# EAGLE design weather station 3 (EAGLE 7.2.0)
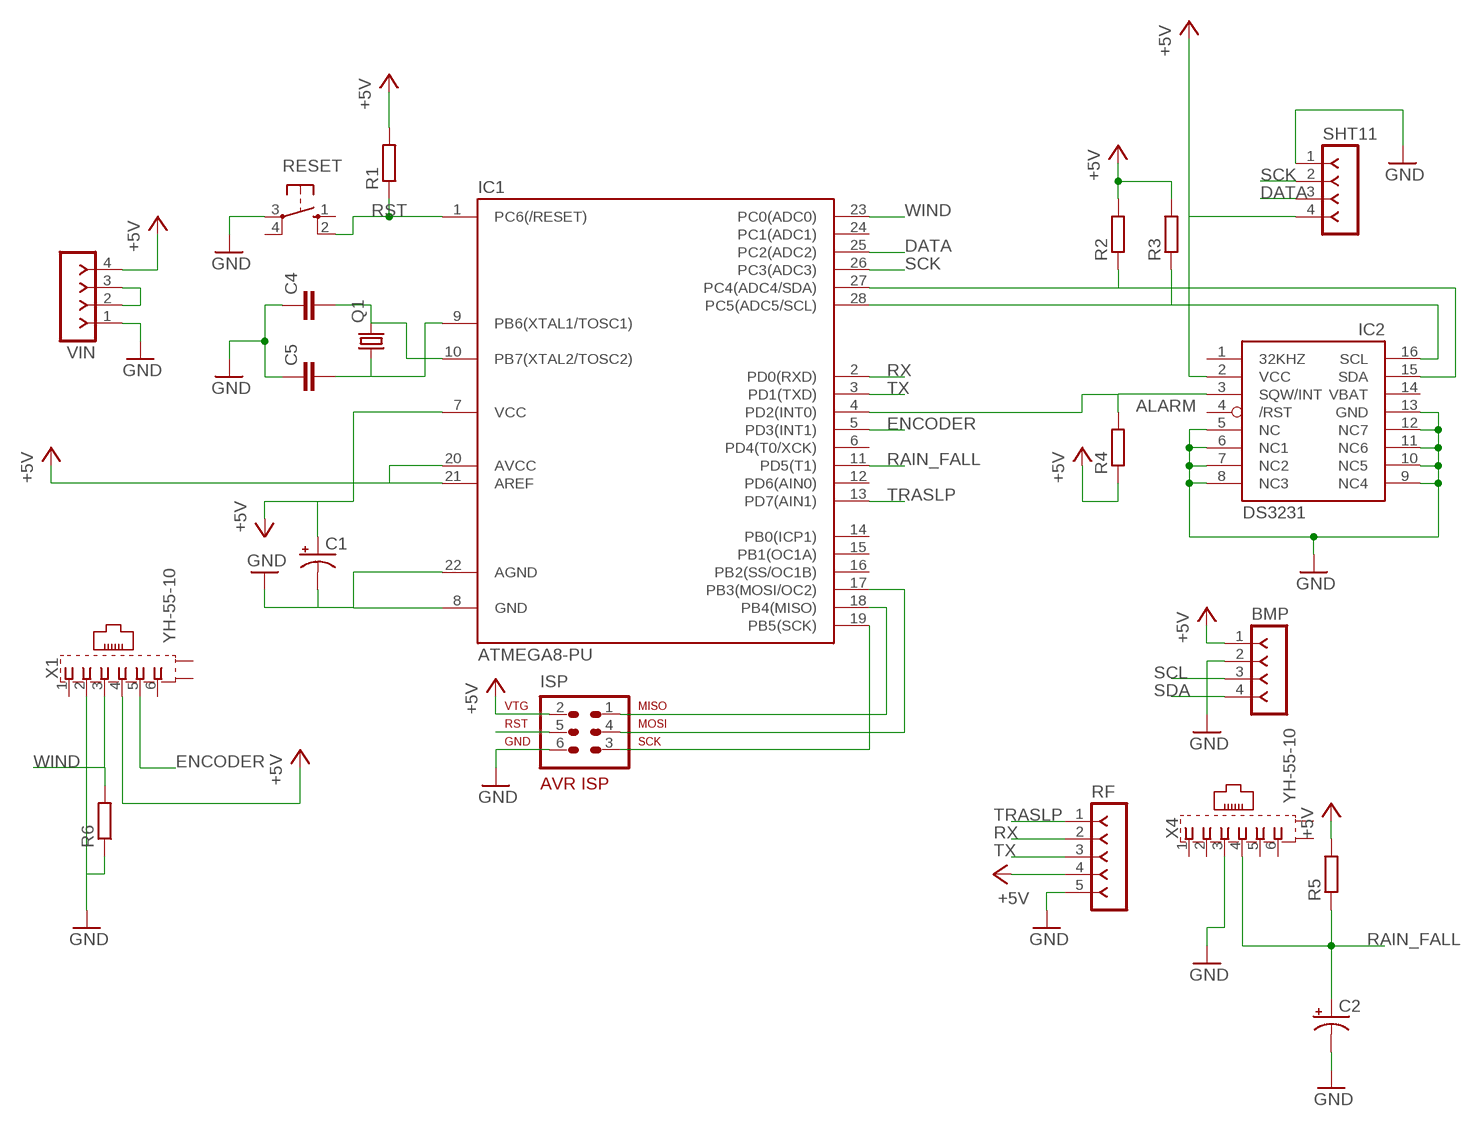
[diagram p0: schematic, sheet 1]

## Parts
BMP  F-1X04-SIP-100-40  [SIP-100-04-40]
C1  10UF-25V-20%(PTH)  [CPOL-RADIAL-10UF-25V]
C2  10UF-25V-20%(PTH)  [CPOL-RADIAL-10UF-25V]
C4  C-EU025-024X044  [C025-024X044]
C5  C-EU025-024X044  [C025-024X044]
IC1  ATMEGA8-PU  [DIL28-3]
IC2  DS3231/SO  [SO16W]
ISP  AVR-ISP-6  [AVR-ISP-6]
Q1  CRYSTALHC49S  [HC49/S]
R1  R-EU_0204/7  [0204/7]
R2  R-EU_0204/7  [0204/7]
R3  R-EU_0204/7  [0204/7]
R4  R-EU_0204/7  [0204/7]
R5  R-EU_0204/7  [0204/7]
R6  R-EU_0204/7  [0204/7]
RESET  10-XX  [B3F-10XX]
RF  F-1X05-SIP-100-40  [SIP-100-05-40]
SHT11  F-1X04-SIP-100-40  [SIP-100-04-40]
VIN  F-1X04-SIP-100-40Y  [SIP-100-04-40Y]
X1  YH-55-10  [YH-55-10]
X4  YH-55-10  [YH-55-10]

## Nets
+5V: BMP.1 C1.1(+) IC1.7(VCC) IC1.20(AVCC) IC1.21(AREF) IC2.2(VCC) ISP.2 R1.2 R2.2 R3.2 R4.1 R5.2 RF.4 SHT11.4 VIN.4 X1.4
ALARM: IC1.4(PD2(INT0)) IC2.3(SQW/INT) R4.2
DATA: IC1.25(PC2(ADC2)) SHT11.3
ENCODER: IC1.5(PD3(INT1)) X1.5
GND: BMP.2 C1.2(-) C2.2(-) C4.1 C5.1 IC1.8(GND) IC1.22(AGND) IC2.5(NC) IC2.6(NC1) IC2.7(NC2) IC2.8(NC3) IC2.9(NC4) IC2.10(NC5) IC2.11(NC6) IC2.12(NC7) IC2.13(GND) ISP.6 R6.1 RESET.3(P) RF.5 SHT11.1 VIN.1 X1.2 X4.3
N$1: VIN.2 VIN.3
N$2: IC1.18(PB4(MISO)) ISP.1
N$3: C4.2 IC1.10(PB7(XTAL2/TOSC2)) Q1.2
N$4: C5.2 IC1.9(PB6(XTAL1/TOSC1)) Q1.1
N$5: IC1.19(PB5(SCK)) ISP.3
N$8: IC1.17(PB3(MOSI/OC2)) ISP.4
RAIN_FALL: C2.1(+) IC1.11(PD5(T1)) R5.1 X4.4
RST: IC1.1(PC6(/RESET)) ISP.5 R1.1 RESET.2(S1)
RX: IC1.2(PD0(RXD)) RF.2
SCK: IC1.26(PC3(ADC3)) SHT11.2
SCL: BMP.3 IC1.28(PC5(ADC5/SCL)) IC2.16(SCL) R3.1
SDA: BMP.4 IC1.27(PC4(ADC4/SDA)) IC2.15(SDA) R2.1
TRASLP: IC1.13(PD7(AIN1)) RF.1
TX: IC1.3(PD1(TXD)) RF.3
WIND: IC1.23(PC0(ADC0)) R6.2 X1.3
Unconnected: IC1.6(PD4(T0/XCK)) IC1.12(PD6(AIN0)) IC1.14(PB0(ICP1)) IC1.15(PB1(OC1A)) IC1.16(PB2(SS/OC1B)) IC1.24(PC1(ADC1)) IC2.1(32KHZ) IC2.4(/RST) RESET.1(S) RESET.4(P1) X1.1 X1.6 X1.S1(S) X1.S2(S) X4.1 X4.2 X4.5 X4.6 X4.S1(S) X4.S2(S)

## Power pins joined to a net without a drawn wire
VBAT: IC2.14(VBAT)

## Library data of the parts
BMP SHT11 VIN = con-headers-jp:F-1X04-: FEMALE HEADER
C1 C2 = SparkFun-Capacitors:10UF-25V-20%(PTH): CAP-08440; PROD_ID: CAP-08440
C4 C5 = rcl:C-EU: CAPACITOR, European symbol
IC1 = atmega8:ATMEGA8-PU
IC2 = adafruit:DS3231
ISP = atmel-1:AVR-ISP-6: AVR ISP-6 Serial Programming Header
Q1 = crystal:CRYSTAL: CRYSTAL; OC_FARNELL: 1667008; OC_NEWARK: unknown
R1-R6 = rcl:R-EU_: RESISTOR, European symbol
RESET = switch-omron:10-XX: OMRON SWITCH; MPN: B3F-1000; OC_FARNELL: 176432; OC_NEWARK: 36M3542
RF = con-headers-jp:F-1X05-: FEMALE HEADER
X1 X4 = con-wenzhou-yihua:YH-55-10: RJ11 6 connects Source: YH-55-10.pdf; OC_FARNELL: unknown; OC_NEWARK: unknown

## Board
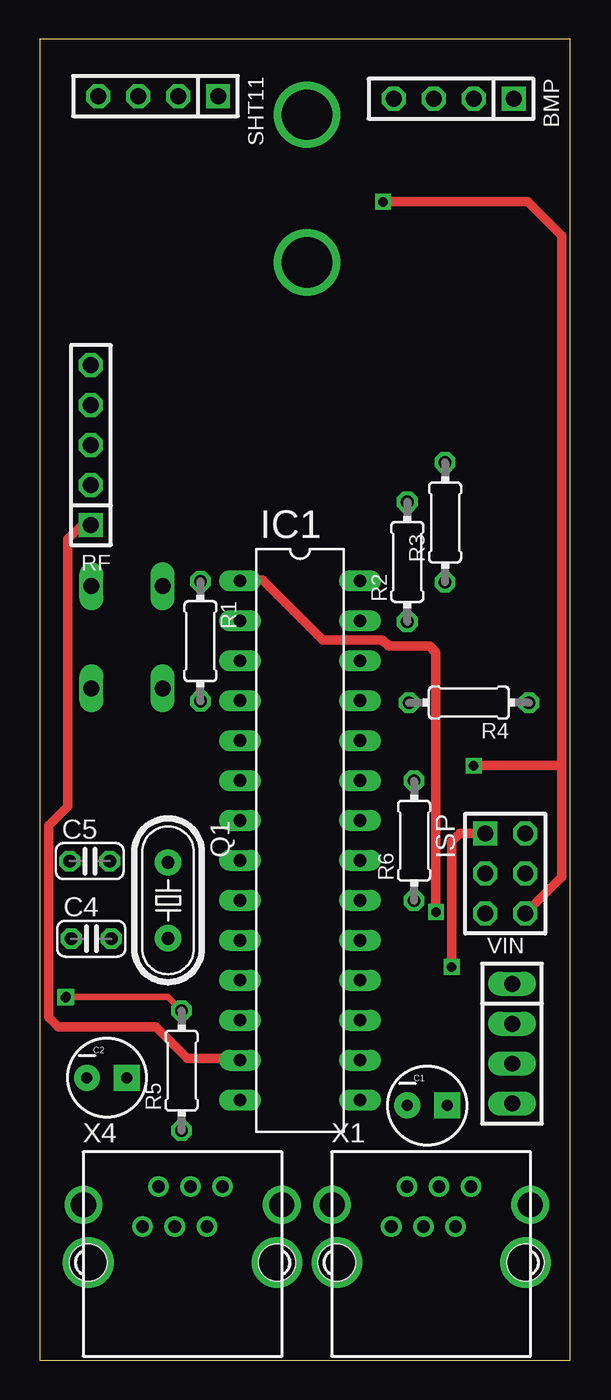
[diagram p1: board, top side]
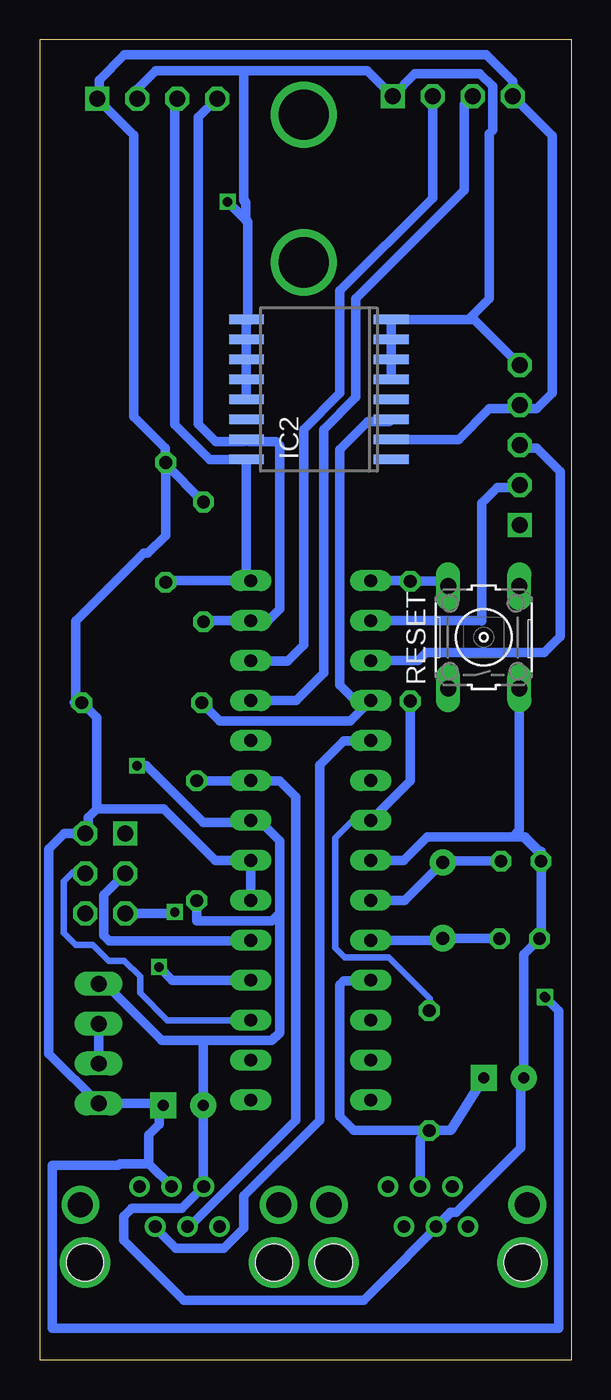
[diagram p2: board, bottom side, seen from below]

Size 33.73 x 83.99 mm. Coordinates in mm from the lower left corner, seen from the top.
Outline: 0,0 33.73,0 33.73,83.99 0,83.99 0,0
Copper layers (1*16): Top 0.035mm / dielectric 1.5mm / Bottom 0.035mm
Design rules "default": minimum track width 10mil, minimum drill 24mil, track to track 8mil, track to pad 8mil, pad to pad 8mil, via to via 8mil, smd to smd 8mil, copper to edge 40mil, drill to drill 8mil, minimum pad ring 10mil, minimum via ring 8mil, stop-mask expansion 4mil, vias tented up to drill 0mil, thermal gap 10mil

### Footprints (pad centres in the part's own frame; a part is rotated, then mirrored left to right if it is on the bottom)
SIP-100-04-40 = drill 1.016 pad 1.422 square: 1 -3.81,0 | drill 1.016 pad 1.422 octagon: 2 -1.27,0; 3 1.27,0; 4 3.81,0
CPOL-RADIAL-10UF-25V = drill 0.7 pad 1.651 square: 1 1.27,0 | drill 0.7 pad 1.651: 2 -1.27,0
C025-024X044 = drill 0.813 octagon: 1 -1.27,0; 2 1.27,0
DIL28-3 = drill 0.813 long: 1 -16.51,-3.81; 2 -13.97,-3.81; 3 -11.43,-3.81; 4 -8.89,-3.81; 5 -6.35,-3.81; 6 -3.81,-3.81; 7 -1.27,-3.81; 8 1.27,-3.81; 9 3.81,-3.81; 10 6.35,-3.81; 11 8.89,-3.81; 12 11.43,-3.81; 13 13.97,-3.81; 14 16.51,-3.81; 15 16.51,3.81; 16 13.97,3.81; 17 11.43,3.81; 18 8.89,3.81; 19 6.35,3.81; 20 3.81,3.81; 21 1.27,3.81; 22 -1.27,3.81; 23 -3.81,3.81; 24 -6.35,3.81; 25 -8.89,3.81; 26 -11.43,3.81; 27 -13.97,3.81; 28 -16.51,3.81
SO16W = smd 0.6 x 2.2: 1 -4.445,-4.6; 2 -3.175,-4.6; 3 -1.905,-4.6; 4 -0.635,-4.6; 5 0.635,-4.6; 6 1.905,-4.6; 7 3.175,-4.6; 8 4.445,-4.6; 9 4.445,4.6; 10 3.175,4.6; 11 1.905,4.6; 12 0.635,4.6; 13 -0.635,4.6; 14 -1.905,4.6; 15 -3.175,4.6; 16 -4.445,4.6
AVR-ISP-6 = drill 1.016 square: 1 -2.54,-1.27 | drill 1.016 octagon: 2 -2.54,1.27; 3 0,-1.27; 4 0,1.27; 5 2.54,-1.27; 6 2.54,1.27
HC49/S = drill 0.813 pad 1.676: 1 -2.413,0; 2 2.413,0
0204/7 = drill 0.813 octagon: 1 -3.81,0; 2 3.81,0
B3F-10XX = drill 1.016 long: 1 -3.251,2.261; 2 3.251,2.261; 3 -3.251,-2.261; 4 3.251,-2.261
SIP-100-05-40 = drill 1.016 pad 1.422 square: 1 -5.08,0 | drill 1.016 pad 1.422 octagon: 2 -2.54,0; 3 0,0; 4 2.54,0; 5 5.08,0
SIP-100-04-40Y = drill 1.016 long: 1 -3.81,0; 2 -1.27,0; 3 1.27,0; 4 3.81,0
YH-55-10 = drill 0.8 pad 1.3: 1 -2.54,2.3; 2 -1.54,4.84; 3 -0.5,2.3; 4 0.5,4.84; 5 1.54,2.3; 6 2.54,4.84 | drill 1.6 pad 2.184: S1 -6.3,3.68; S2 6.3,3.68 | hole 2.36: -6,0; 6,0

### Placement (x,y rotation side)
BMP  26.31,80.21 180 top
C1  24.65,16.19 0 top
C2  4.28,17.97 0 top
C4  3.28,26.8 0 top
C5  3.18,31.73 0 top
IC1  16.55,33.05 270 top
IC2  16.03,61.72 90 bottom
ISP  29.6,30.94 270 top
Q1  8.16,29.24 270 top
R1  10.22,45.72 270 top
R2  23.37,50.76 90 top
R3  25.77,53.27 90 top
R4  27.29,41.81 180 top
R5  9.02,18.41 90 top
R6  23.8,33.03 90 top
RESET  5.55,45.97 90 bottom
RF  3.26,58.18 90 top
SHT11  7.53,80.38 180 top
VIN  30.03,20.13 270 top
X1  24.89,6.2 0 top
X4  9.09,6.2 0 top

### Tracks (layer width: path | path; a pad name or v marks a point on that pad's centre or on a via)
+5V  (via drill 0.6)
  Top 0.406: v1.69,23.11 8.13,23.11 R5.2
  Top 0.61: v1.69,23.11 v1.64,23.06
  Bottom 0.406: IC1.7 13.87,34.32 14.99,33.2 14.99,26.2 14.39,25.6 11.59,25.6 8.99,23 8.99,22.25 R5.2
  Bottom 0.61: IC1.20 IC1.21 22.62,31.78 25.89,35.05 30.14,35.05 | R1.2 10.22,36.84 IC1.7 | 26.85,12.5 28.69,12.5 28.79,12.4 32.99,12.4 32.99,2.03 0.79,2.03 0.79,22.21 v1.64,23.06 | 26.85,12.5 X1.4 | 26.85,12.5 26.85,14.34 26.19,15 26.19,15.92 C1.1 26.05,16.32 VIN.4 33.19,19.48 33.19,32.5 32.21,33.48 ISP.2 30.69,33.66 30.69,34.5 30.14,35.05 | 30.14,35.05 30.14,40.85 R4.1 31.58,41.81 31.48,41.91 31.48,46.99 27.16,51.31 26.91,51.31 25.77,52.45 R3.2 25.77,56.97 R2.2 25.79,57 25.79,58 27.79,60 27.79,77.88 BMP.1 29.99,80.35 29.99,81.4 28.39,83 5.39,83 3.72,81.33 SHT11.4 1.19,77.86 1.19,61.5 2.19,60.5 3.49,60.5 | 3.49,60.5 5.19,60.5 7.14,58.55 IC2.2 | 3.49,60.5 RF.4
ALARM
  Bottom 0.61: R4.2 23.51,41.81 22.34,40.64 14.04,40.64 IC1.4 13.73,41.94 14.72,42.93 14.72,57.91 12.94,59.69 11.56,59.69 IC2.3
DATA
  Bottom 0.61: IC1.25 17.48,41.94 15.73,43.69 15.73,59.18 13.69,61.22 13.69,67.5 6.79,74.4 6.79,79.85 SHT11.3
ENCODER
  Bottom 0.61: X1.5 26.43,8.41 25.13,7.11 22.08,7.11 20.79,8.4 20.79,10.44 15.99,15.24 15.99,37.85 14.46,39.37 12.77,39.37 IC1.5
GND  (via drill 0.6)
  Top 0.406: ISP.6 30.87,28.48 33.19,30.8 33.19,37.6 32.99,37.8
  Top 0.61: v21.83,73.66 31.03,73.66 33.19,71.5 33.19,30.8 33.19,30.73 ISP.6 | 32.99,37.8 v27.59,37.8
  Bottom 0.61: 7.6,9.4 7.69,9.4 X4.3 | 1.91,32.26 C5.1 1.91,26.9 C4.1 3.01,25.8 C2.2 3.19,17.79 3.19,13.5 7.29,9.4 7.6,9.4 | 1.91,32.26 1.91,32.36 | 3.03,33.27 2.93,33.27 1.91,32.26 | 18.53,28.45 18.53,33.02 19.83,34.32 IC1.22 20.48,34.2 23.39,34.2 26.99,37.8 v27.59,37.8 | 18.53,28.45 19.03,27.94 23.79,27.94 R6.1 | 18.53,28.45 18.53,20.83 19.03,20.32 23.19,20.32 | 23.19,20.32 26.01,20.32 29.19,23.5 29.59,23.5 VIN.1 | IC1.8 10.62,31.78 9.13,33.27 3.69,33.27 | 3.69,33.27 3.03,33.27 | 3.03,33.27 2.02,32.26 | 7.6,9.4 13.19,3.81 24.62,3.81 28.43,7.62 28.43,9.14 27.92,9.65 24.74,9.65 X1.2 23.38,11.07 C1.2 23.38,20.13 23.19,20.32 | IC2.8 IC2.7 IC2.6 IC2.5 | IC2.9 IC2.10 IC2.11 | IC2.11 IC2.12 IC2.13 | IC2.11 20.63,65.97 20.56,66.04 20.56,72.39 v21.83,73.66 21.83,73.64 20.69,72.5 20.69,73.63 20.79,73.73 20.79,82 | RESET.3 3.29,33.67 3.69,33.27 | IC2.8 6.17,66.17 RF.5 | IC2.8 6.52,66.17 5.19,67.5 5.19,78 4.99,78.2 4.99,81 5.79,81.8 9.92,81.8 SHT11.1 12.95,82 20.79,82 | BMP.2 27.58,80.81 26.39,82 20.79,82
N$1
  Bottom 0.61: VIN.2 VIN.3
N$2  (via drill 0.6)
  Top 0.61: v26.19,25 26.19,33 26.69,33.5 28.31,33.5 ISP.1
  Bottom 0.61: IC1.18 25.35,24.16 v26.19,25
N$3
  Bottom 0.61: IC1.10 8.29,26.7 Q1.2 4.58,26.83 C4.2
N$4
  Bottom 0.61: IC1.9 10.57,29.24 Q1.1 8.08,31.73 C5.2
N$5
  Bottom 0.61: IC1.19 20.39,26.67 29.36,26.67 29.69,27 29.69,29.58 ISP.3
N$8
  Bottom 0.406: IC1.17 25.67,21.62 27.39,23.34 27.39,24.4 28.39,25.4 29.39,25.4 30.41,26.42 31.48,26.42 32.24,27.18 32.24,30.45 31.69,31 30.92,31 ISP.4
N$10  (via drill 3.2)
  other vias: 16.99,69.8 16.99,79.2
N$12  (via drill 2.2 pad 1.27)
  other vias: 3.09,6.2
N$13  (via drill 2.2 pad 1.27)
  other vias: 15.09,6.2
N$14  (via drill 2.2 pad 1.27)
  other vias: 18.89,6.2
N$15  (via drill 2.2 pad 1.27)
  other vias: 30.89,6.2
RAIN_FALL
  Bottom 0.61: X4.4 9.59,14.03 R5.1 | R5.1 7.64,14.6 C2.1 | R5.1 13.83,14.6 14.72,15.49 14.72,23.88 14.46,24.13 12.77,24.13 IC1.11
RST  (via drill 0.6)
  Top 0.61: v25.19,28.5 25.19,45 24.79,45.4 22.19,45.4 21.79,45.8 17.99,45.8 14.19,49.6 12.78,49.6 IC1.1
  Bottom 0.61: IC1.1 10.25,49.56 R1.1 8.12,49.53 RESET.2 | ISP.5 25.29,28.4 v25.19,28.5
RX
  Bottom 0.61: IC1.2 5.71,47.02 5.69,47 5.69,54.5 4.69,55.5 3.41,55.5 RF.2
SCK
  Bottom 0.61: IC1.26 20.33,44.45 18.02,44.45 17,45.47 17,59.18 14.69,61.49 14.69,68 8.8,73.89 SHT11.2
SCL
  Bottom 0.61: R3.1 25.67,49.56 IC1.28 20.63,49.83 IC2.16 22.97,57.28 25.19,59.5 25.19,80.07 BMP.3
SDA
  Bottom 0.61: R2.1 23.3,47.02 IC1.27 19.26,47.02 18.53,47.75 18.53,58.17 18.78,58.42 20.5,58.42 IC2.15 20.76,58.42 22.59,58.42 23.69,59.52 23.69,79.03 BMP.4
TRASLP
  Top 0.61: RF.1 2.69,53.1 1.79,52.2 1.79,35.2 0.59,34 0.59,21.8 1.19,21.2 7.39,21.2 9.39,19.2 12.62,19.2 IC1.13
TX
  Bottom 0.61: IC1.3 9.71,44.48 9.19,45 1.69,45 0.69,46 0.69,56.5 2.19,58 3.08,58 RF.3
WIND
  Bottom 0.61: R6.2 20.38,36.84 IC1.23 20.33,36.83 18.53,36.83 17.51,35.81 17.51,15.24 24.25,8.5 X1.3